# EAGLE design XICIE_AFE_SMD_revC (EAGLE 6.5.0)
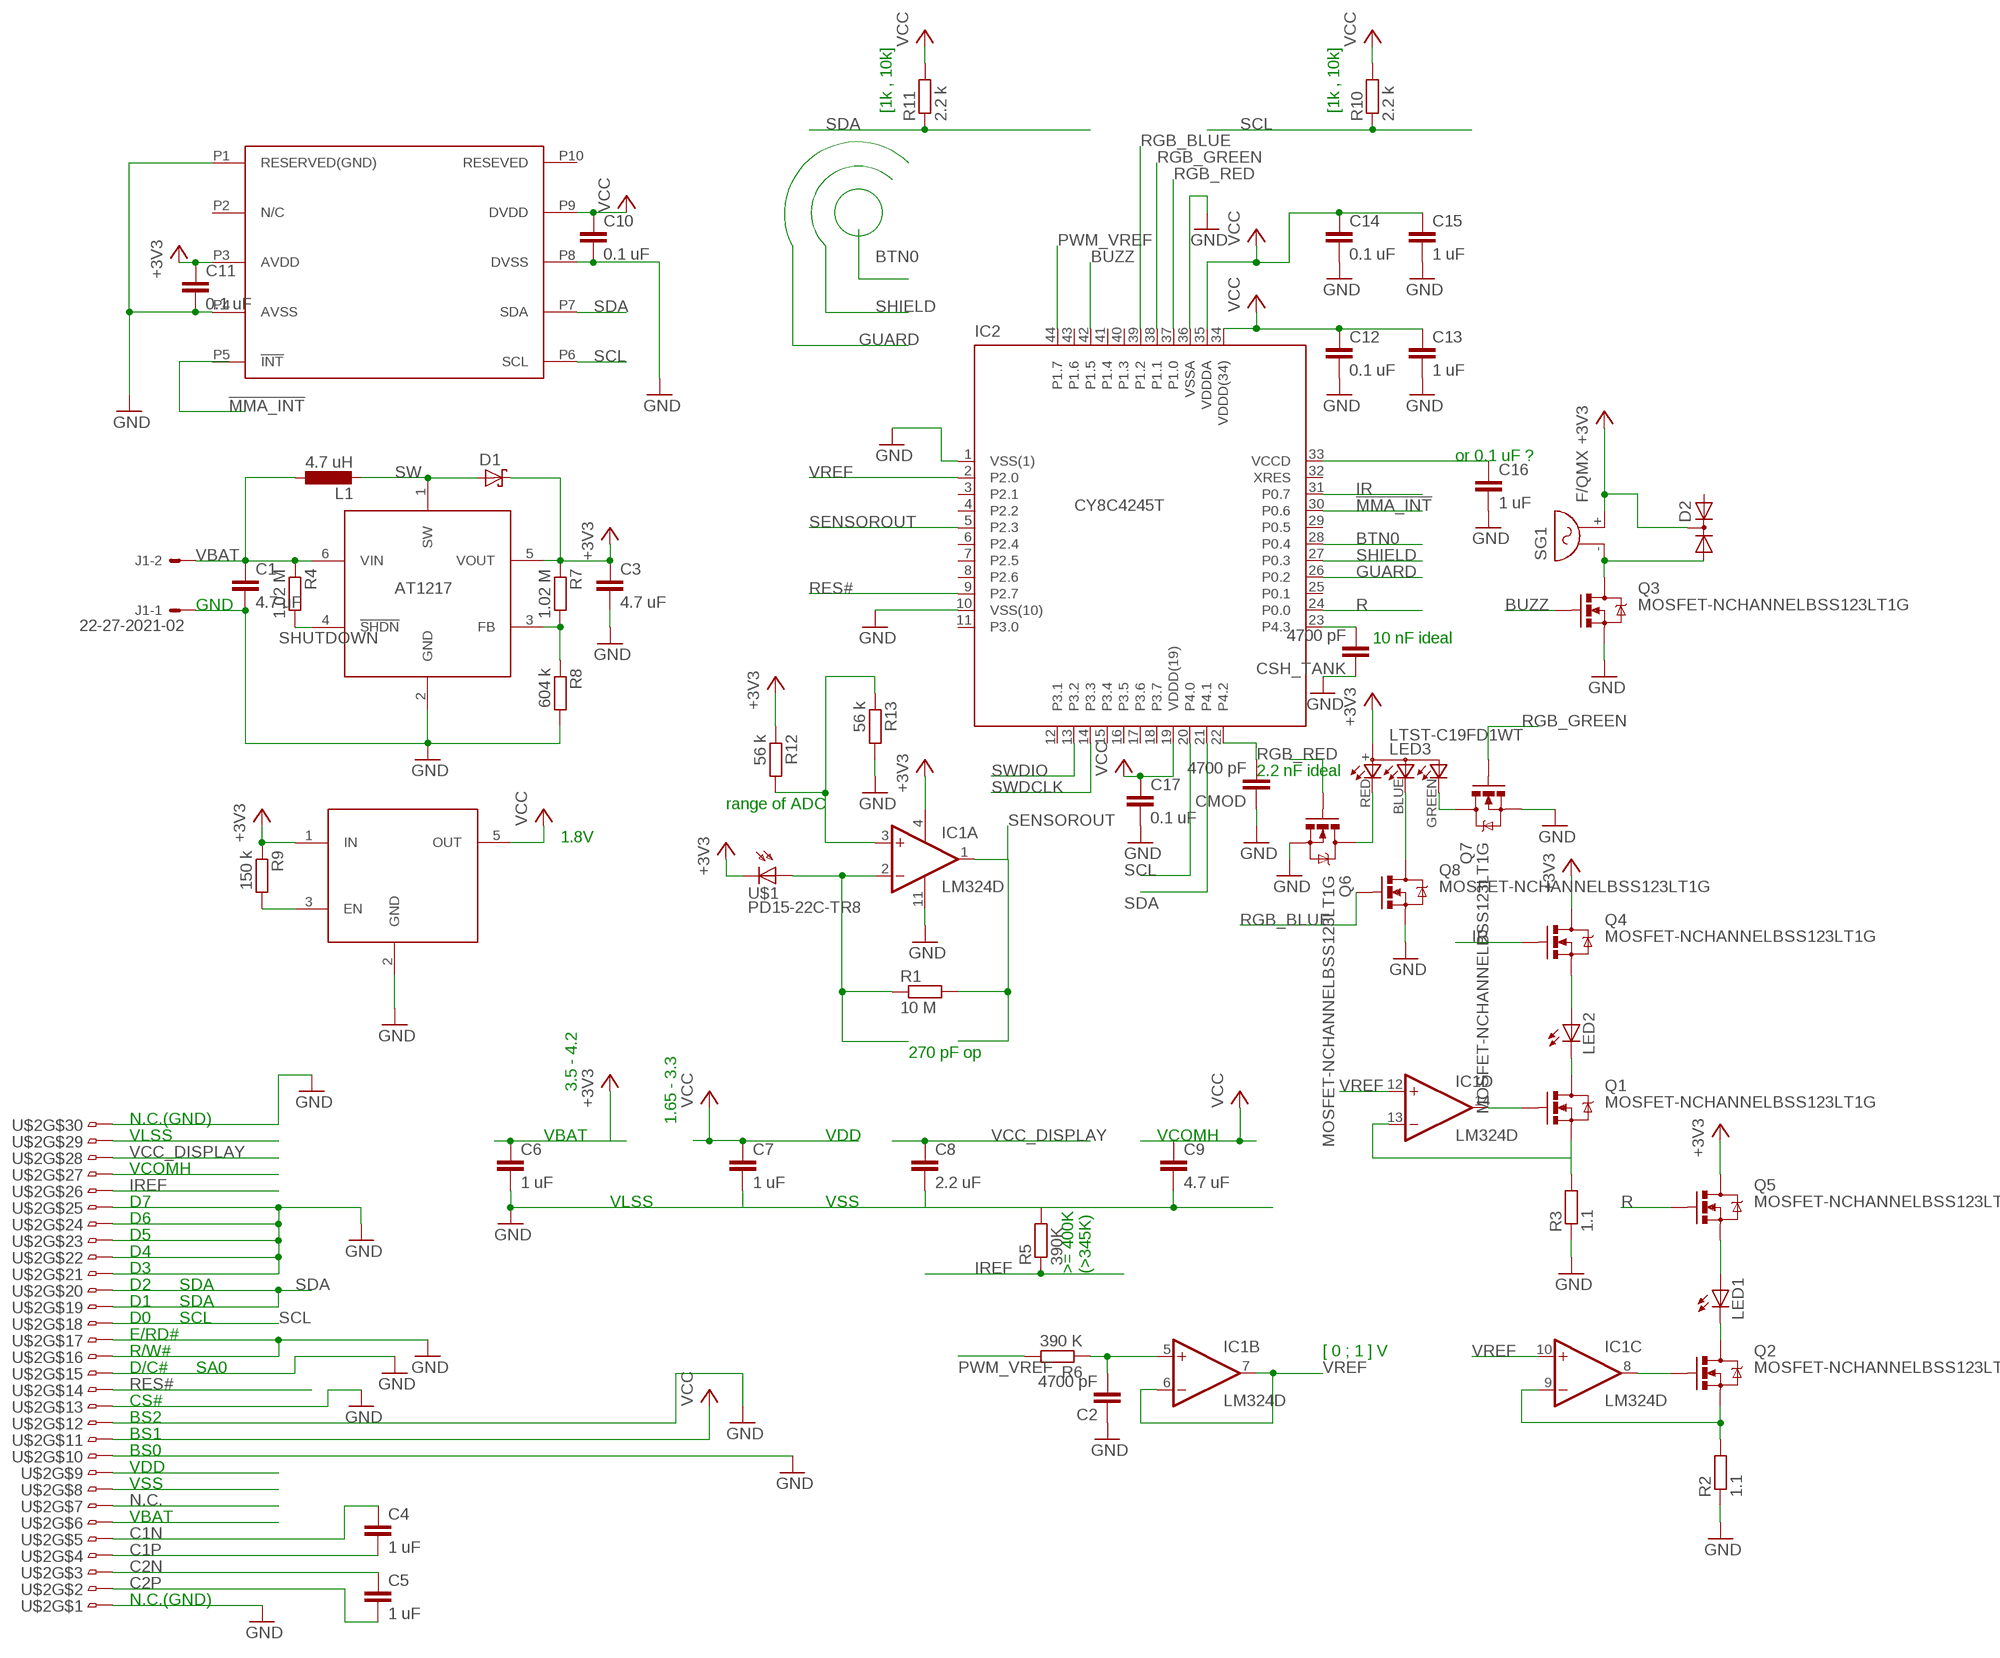
[diagram p0: schematic, sheet 1]

## Parts
C1  4.7 uF  C-EUC0603  [C0603]
C2  4700 pF  C-EUC0402  [C0402]
C3  4.7 uF  C-EUC0603  [C0603]
C4  1 uF  C-EUC0402  [C0402]
C5  1 uF  C-EUC0402  [C0402]
C6  1 uF  C-EUC0402  [C0402]
C7  1 uF  C-EUC0402  [C0402]
C8  2.2 uF  C-EUC0603  [C0603]
C9  4.7 uF  C-EUC0603  [C0603]
C10  0.1 uF  C-EUC0402  [C0402]
C11  0.1 uF  C-EUC0402  [C0402]
C12  0.1 uF  C-EUC0402  [C0402]
C13  1 uF  C-EUC0402  [C0402]
C14  0.1 uF  C-EUC0402  [C0402]
C15  1 uF  C-EUC0402  [C0402]
C16  1 uF  C-EUC0402  [C0402]
C17  0.1 uF  C-EUC0402  [C0402]
CMOD  4700 pF  C-EUC0402  [C0402]
CSH_TANK  4700 pF  C-EUC0402  [C0402]
D1  SCHOTTKY-DIODESMD  [SMINI2-F5-B]
D2  DIODE-2AC|CASOT23  [SOT23]
IC1  LM324D  [SO14]
IC2  CY8C4245T  [TQFP44]
IC3  AAT1217  [SOT23-6]
J1  22-27-2021-02  [6410-02]
L1  4.7 uH  L-EU  [L2518]
LED1  LED5MM  [LED5MM]
LED2  LED5MM  [LED5MM]
LED3  LTST-C19FD1WT  [GM1WA55311A]
Q1  MOSFET-NCHANNELBSS123LT1G  [SOT23]
Q2  MOSFET-NCHANNELBSS123LT1G  [SOT23]
Q3  MOSFET-NCHANNELBSS123LT1G  [SOT23]
Q4  MOSFET-NCHANNELBSS123LT1G  [SOT23]
Q5  MOSFET-NCHANNELBSS123LT1G  [SOT23]
Q6  MOSFET-NCHANNELBSS123LT1G  [SOT23]
Q7  MOSFET-NCHANNELBSS123LT1G  [SOT23]
Q8  MOSFET-NCHANNELBSS123LT1G  [SOT23]
R1  10 M  R-EU_R0402  [R0402]
R2  1.1  R-EU_R0402  [R0402]
R3  1.1  R-EU_R0402  [R0402]
R4  1.02 M  R-EU_R0805  [R0805]
R5  390K  R-EU_R0603  [R0603]
R6  390 K  R-EU_R0603  [R0603]
R7  1.02 M  R-EU_R0805  [R0805]
R8  604 k  R-EU_R0603  [R0603]
R9  150 k  R-EU_R0603  [R0603]
R10  2.2 k  R-EU_R0402  [R0402]
R11  2.2 k  R-EU_R0402  [R0402]
R12  56 k  R-EU_R0603  [R0603]
R13  56 k  R-EU_R0603  [R0603]
SG1  F/QMX  [F/QMX]
U$1  PD15-22C-TR8  [PHOTO_SMD]
U$2  ER-OLED0.96  [FLEX0.7X30]
U$3  AAT3221  [SOT23-5]
U$4  MMA7660FC  [DFN10]

## Nets
!MMA_INT: IC2.30(P0.6)
+3V3 [V]: C3.1 C6.1 C11.1 D1.C D2.3(C) IC1.4(P:V+) IC3.5(VOUT) LED3.+(A) Q4.3(D) Q5.3(D) R7.1 R9.1 R12.1 SG1.+ U$1.CATHODE1(C) U$1.CATHODE2(C) U$2.P6 U$3.1(IN) U$4.P3(AVDD)
BTN0: IC2.28(P0.4)
BUZZ: IC2.42(P1.5) Q3.1(G)
C1N: C4.1 U$2.P5
C1P: C4.2 U$2.P4
C2N: C5.1 U$2.P3
C2P: C5.2 U$2.P2
GND [GND]: C1.2 C2.1 C3.2 C6.2 C7.2 C8.2 C9.2 C10.2 C11.2 C12.2 C13.2 C14.2 C15.2 C16.2 C17.2 CMOD.1 CSH_TANK.1 IC1.11(P:V-) IC2.1(VSS(1)) IC2.10(VSS(10)) IC2.36(VSSA) IC3.2(GND) J1.1 Q3.2(S) Q6.2(S) Q7.2(S) Q8.2(S) R2.1 R3.1 R5.2 R8.2 R13.2 U$2.P1 U$2.P8 U$2.P10 U$2.P12 U$2.P13 U$2.P15 U$2.P16 U$2.P17 U$2.P21 U$2.P22 U$2.P23 U$2.P24 U$2.P25 U$2.P29 U$2.P30 U$3.2(GND) U$4.P1(RESERVED(GND)) U$4.P4(AVSS) U$4.P8(DVSS)
GUARD: IC2.26(P0.2)
IR: IC2.31(P0.7) Q4.1(G)
IREF: R5.1 U$2.P26
N$1: IC1.2(A:-IN) R1.1 U$1.ANODE1(A) U$1.ANODE2(A)
N$3: IC1.9(C:-IN) Q2.2(S) R2.2
N$4: LED2.A Q4.2(S)
N$5: LED1.K(C) Q2.3(D)
N$6: LED2.K(C) Q1.3(D)
N$7: IC1.8(C:OUT) Q2.1(G)
N$8: IC1.13(D:-IN) Q1.2(S) R3.2
N$9: C2.2 IC1.5(B:+IN) R6.1
N$10 [V]: C16.1 IC2.33(VCCD)
N$12: IC3.3(FB) R7.2 R8.1
N$13: D2.1(A1) Q3.3(D) SG1.-
N$14: R9.2 U$3.3(EN)
N$15: IC1.3(A:+IN) R12.2 R13.1
N$16: LED1.A Q5.2(S)
N$17: LED3.RED(CRED) Q6.3(D)
N$18: LED3.BLUE(CBLUE) Q8.3(D)
N$19: IC1.14(D:OUT) Q1.1(G)
N$20: LED3.GREEN(CGREEN) Q7.3(D)
N$21: CMOD.2 IC2.22(P4.2)
N$22: CSH_TANK.2 IC2.23(P4.3)
N.C.: U$2.P7
PWM_VREF: IC2.44(P1.7) R6.2
R: IC2.24(P0.0) Q5.1(G)
RES#: IC2.9(P2.7) U$2.P14
RGB_BLUE: IC2.39(P1.2) Q8.1(G)
RGB_GREEN: IC2.38(P1.1) Q7.1(G)
RGB_RED: IC2.37(P1.0) Q6.1(G)
SCL: IC2.20(P4.0) R10.1 U$2.P18 U$4.P6(SCL)
SDA: IC2.21(P4.1) R11.1 U$2.P19 U$2.P20 U$4.P7(SDA)
SENSOROUT: IC1.1(A:OUT) IC2.5(P2.3) R1.2
SHIELD: IC2.27(P0.3)
SHUTDOWN: IC3.4(!SHDN) R4.2
SW: D1.A IC3.1(SW) L1.2
SWDCLK: IC2.14(P3.3)
SWDIO: IC2.13(P3.2)
VBAT [V]: C1.1 IC3.6(VIN) J1.2 L1.1 R4.1
VCC [V]: C7.1 C9.1 C10.1 C12.1 C13.1 C14.1 C15.1 C17.1 IC2.19(VDDD(19)) IC2.34(VDDD(34)) IC2.35(VDDDA) R10.2 R11.2 U$2.P9 U$2.P11 U$2.P27 U$3.5(OUT) U$4.P9(DVDD)
VCC_DISPLAY [V]: C8.1 U$2.P28
VREF: IC1.6(B:-IN) IC1.7(B:OUT) IC1.10(C:+IN) IC1.12(D:+IN) IC2.2(P2.0)
Unconnected: D2.2(A2) IC2.3(P2.1) IC2.6(P2.4) IC2.7(P2.5) IC2.11(P3.0) IC2.12(P3.1) IC2.15(P3.4) IC2.16(P3.5) IC2.18(P3.7) IC2.25(P0.1) IC2.29(P0.5) IC2.32(XRES) IC2.40(P1.3) IC2.41(P1.4) IC2.43(P1.6) U$4.P2(N/C) U$4.P5(!INT) U$4.P10(RESEVED)

## Notes on the sheet
- [1k , 10k] | [1k , 10k]
- or 0.1 uF ?
- GND
- 10 nF ideal
- 2.2 nF ideal
- range of ADC
- 1.8V
- 270 pF op
- 3.5 - 4.2
- N.C.(GND) | 1.65 - 3.3
- VLSS | VBAT | VDD | VCOMH
- VCOMH
- D7 | VLSS | VSS
- D6
- D5
- D4
- D3
- >= 400K
  (>345K)
- D2 | SDA
- D1 | SDA
- D0 | SCL
- E/RD#
- R/W# | [ 0 ; 1 ] V
- D/C# | SA0
- CS#
- BS2
- BS1
- BS0
- VDD
- VSS
- VBAT
- N.C.(GND)

## Power pins joined to a net without a drawn wire
P2.2: IC2.4(P2.2)
P2.6: IC2.8(P2.6)
P3.6: IC2.17(P3.6)

## Library data of the parts
C1-C17 CMOD CSH_TANK = rcl:C-EU: CAPACITOR, European symbol
D1 = juliano:SCHOTTKY-DIODE: Schottky Diode
D2 = diode:DIODE-2AC|CA: Dual DIODE Anode-Cathode|Cathode-Anode
IC1 = linear:LM324: OP AMP
IC2 = juliano:CY8C4245: PSoC® Programmable System-on-Chip TM M8C Processor Speeds up to 24 MHz Source: http://www.cypress.com .. CY8C4245AXI-483; OC_FARNELL: unknown; OC_NEWARK: unknown
IC3 = juliano:AAT1217
J1 = con-molex:22-?-02: CONNECTOR wire to board 2.54 mm (.1 inch) pitch header; OC_FARNELL: unknown; OC_NEWARK: unknown
L1 = juliano:L-EU: INDUCTOR, European symbol
LED1 LED2 = led:LED: LED OSRAM: - CHIPLED LG R971, LG N971, LY N971, LG Q971, LY Q971, LO R971, LY R971 LH N974, LH R974 LS Q976, LO Q976, LY Q976 LO Q996 - Hyper CHIPLED LW Q18S LB Q993, LB Q99A, LB R99A - SideLED LS A670, LO A670, LY A670, LG A670, LP A670 LB A673, LV A673, LT A673, LW A673 LH A674 LY A675 LS A676, LA A676, LO A676, LY A676, LW A676 LS A679, LY A679, LG A679 - Hyper Micro SIDELED® LS Y876, LA Y876, LO Y876, LY Y876 LT Y87S - SmartLED LW L88C, LW L88S LB L89C, LB L89S, LG L890 LS L89K, LO L89K, LY L89K LS L896, LA L896, LO L896, LY L896 - TOPLED LS T670, LO T670, LY T670, LG T670, LP T670 LSG T670, LSP T670, LSY T670, LOP T670, LYG T670 LG T671, LOG T671, LSG T671 LB T673, LV T673, LT T673, LW T673 LH T674 LS T676, LA T676, LO T676, LY T676, LB T676, LH T676, LSB T676, LW T676 LB T67C, LV T67C, LT T67C, LS T67K, LO T67K, LY T67K, LW E67C LS E67B, LA E67B, LO E67B, LY E67B, LB E67C, LV E67C, LT E67C LW T67C LS T679, LY T679, LG T679 LS T770, LO T770, LY T770, LG T770, LP T770 LB T773, LV T773, LT T773, LW T773 LH T774 LS E675, LA E675, LY E675, LS T675 LS T776, LA T776, LO T776, LY T776, LB T776 LHGB T686 LT T68C, LB T68C - Hyper Mini TOPLED® LB M676 - Mini TOPLED Santana® LG M470 LS M47K, LO M47K, LY M47K Source: http://www.osram.convergy.de LUXEON: - LUMILED® LXK2-PW12-R00, LXK2-PW12-S00, LXK2-PW14-U00, LXK2-PW14-V00 LXK2-PM12-R00, LXK2-PM12-S00, LXK2-PM14-U00 LXK2-PE12-Q00, LXK2-PE12-R00, LXK2-PE12-S00, LXK2-PE14-T00, LXK2-PE14-U00 LXK2-PB12-K00, LXK2-PB12-L00, LXK2-PB12-M00, LXK2-PB14-N00, LXK2-PB14-P00, LXK2-PB14-Q00 LXK2-PR12-L00, LXK2-PR12-M00, LXK2-PR14-Q00, LXK2-PR14-R00 LXK2-PD12-Q00, LXK2-PD12-R00, LXK2-PD12-S00 LXK2-PH12-R00, LXK2-PH12-S00 LXK2-PL12-P00, LXK2-PL12-Q00, LXK2-PL12-R00 Source: www.luxeon.com KINGBRIGHT: KA-3528ASYC Source: www.kingbright.com
LED3 = juliano:LTST-C19FD1WT: Chip LED RGB Source: http://optoelectronics.liteon.com/upload/download/DS22-2001-076/S_110_LTST-C19FD1WT.pdf
Q1-Q8 = SparkFun-DiscreteSemi:MOSFET-NCHANNEL: Common NMOSFET Parts MFG P/N Store ID Prod ID FDD8780 TRANS-09984 SI7820DN TRANS-11055 FDS6630A IC-08089 2N7002PW TRANS-11151 FQP30N06L COM-10213 TRANS-10060 BSS123LT1G TRANS-08345 BSS138 TRANS-00830 BS170 2N7000; PROD_ID: TRANS-08345
R1-R4 R6-R13 = rcl:R-EU_: RESISTOR, European symbol
R5 = resistor:R-EU_: RESISTOR, European symbol
SG1 = buzzer:F/QMX: BUZZER Source: Buerklin; OC_FARNELL: unknown; OC_NEWARK: unknown
U$1 = juliano:PD15-22C-TR8
U$2 = juliano:ER-OLED0.96
U$3 = juliano:AAT3221
U$4 = juliano:MMA7660FC

## Board
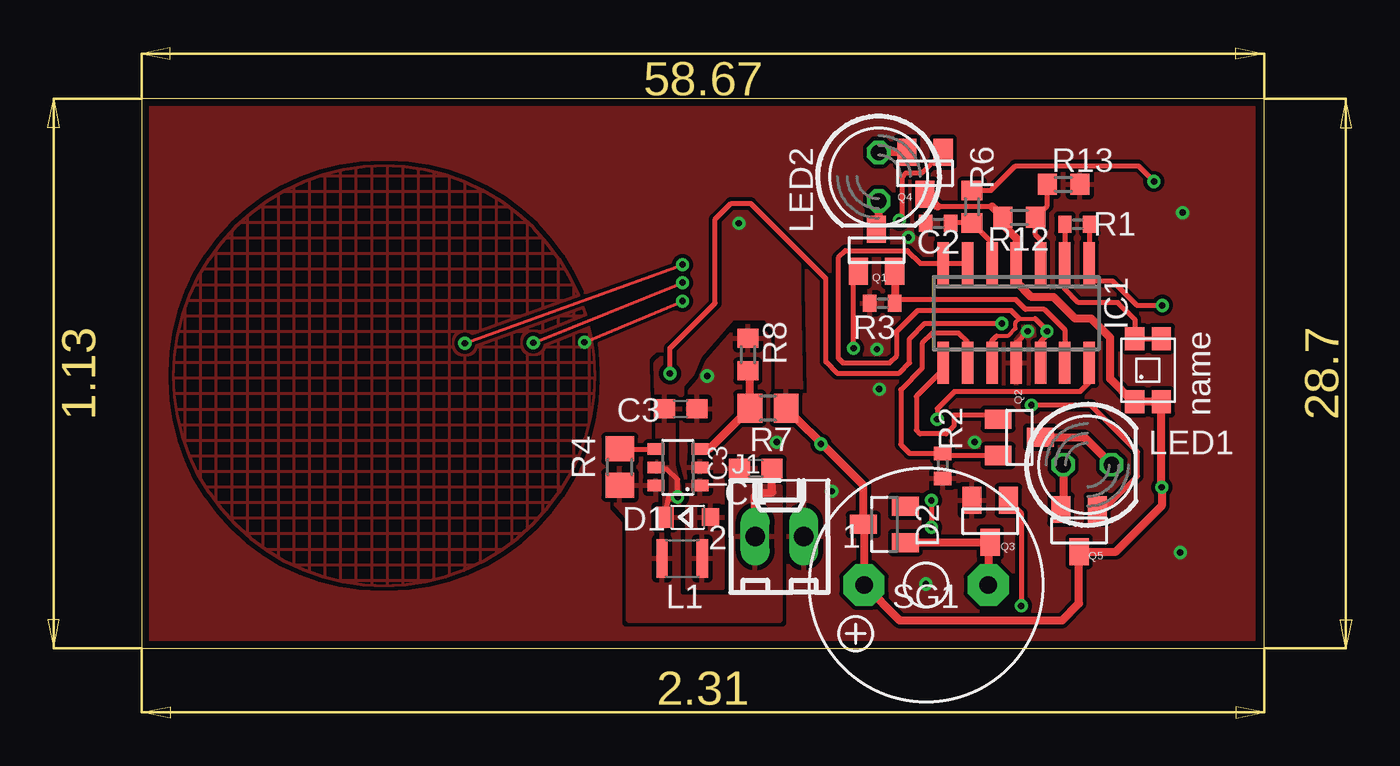
[diagram p1: board, top side]
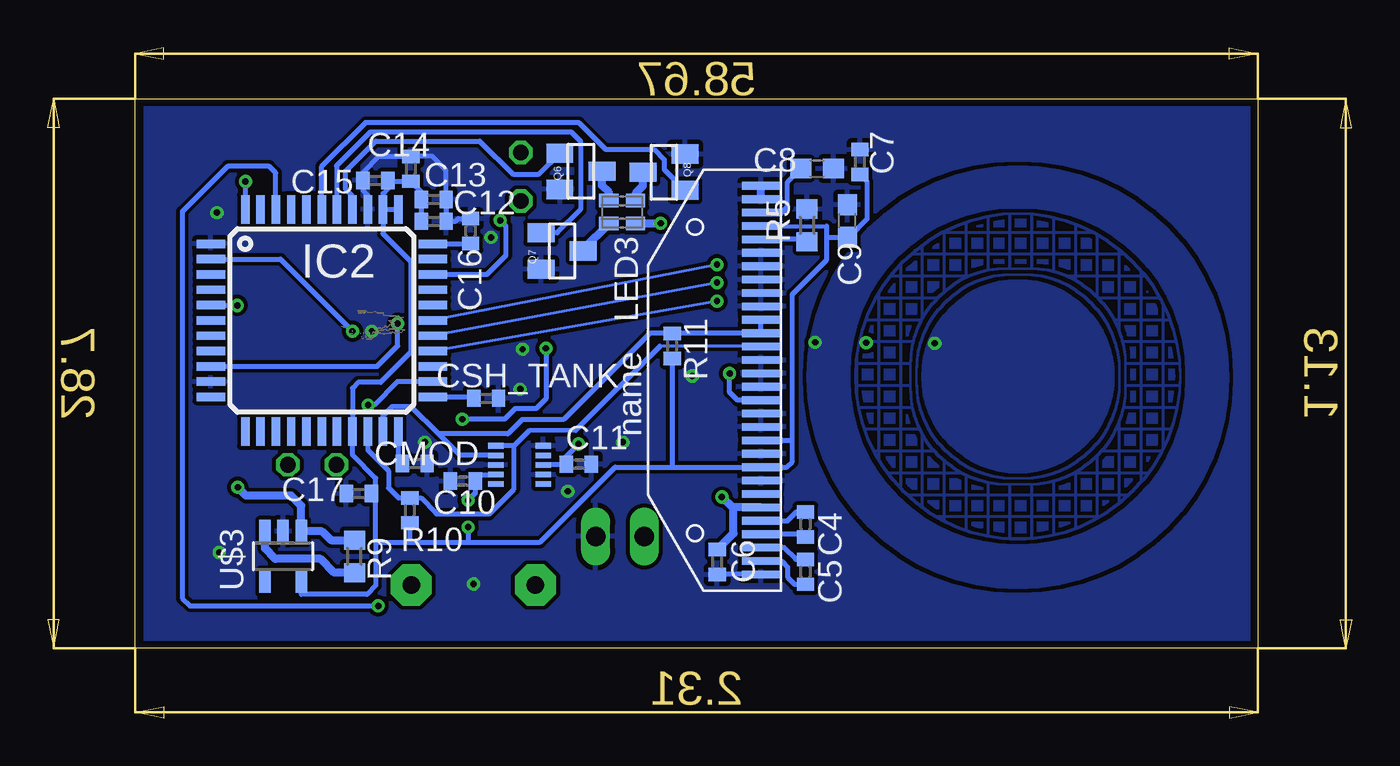
[diagram p2: board, bottom side, seen from below]

Size 58.67 x 28.7 mm. Coordinates in mm from the lower left corner, seen from the top.
Outline: 0,0 58.67,0 58.67,28.7 0,28.7 0,0
Copper layers (1*16): Top 0.0356mm / dielectric 1.5011mm / Bottom 0.0356mm
Design rules "LaenPCBOrder *": minimum track width 6mil, minimum drill 13mil, track to track 8mil, track to pad 8mil, pad to pad 8mil, via to via 8mil, smd to smd 6mil, copper to edge 15mil, drill to drill 6mil, minimum pad ring 7mil, minimum via ring 7mil, stop-mask expansion 3mil, vias tented up to drill 0mil, thermal gap 10mil

### Footprints (pad centres in the part's own frame; a part is rotated, then mirrored left to right if it is on the bottom)
C0603 = smd 1.1 x 1: 1 -0.85,0; 2 0.85,0
C0402 = smd 0.7 x 0.9: 1 -0.65,0; 2 0.65,0
SMINI2-F5-B = smd 0.9 x 0.9: A 1.2,0 | smd 0.9 x 1.1: C -1.2,0
SOT23 = smd 1 x 1.4: 1 -0.95,-1.1; 2 0.95,-1.1; 3 0,1.1
SO14 = smd 0.6 x 2.2: 1 -3.81,-2.6; 2 -2.54,-2.6; 3 -1.27,-2.6; 4 0,-2.6; 5 1.27,-2.6; 6 2.54,-2.6; 7 3.81,-2.6; 8 3.81,2.6; 9 2.54,2.6; 10 1.27,2.6; 11 0,2.6; 12 -1.27,2.6; 13 -2.54,2.6; 14 -3.81,2.6
TQFP44 = smd 1.5 x 0.44: 1 -5.8,4; 2 -5.8,3.2; 3 -5.8,2.4; 4 -5.8,1.6; 5 -5.8,0.8; 6 -5.8,0; 7 -5.8,-0.8; 8 -5.8,-1.6; 9 -5.8,-2.4; 10 -5.8,-3.2; 11 -5.8,-4; 23 5.8,-4; 24 5.8,-3.2; 25 5.8,-2.4; 26 5.8,-1.6; 27 5.8,-0.8; 28 5.8,0; 29 5.8,0.8; 30 5.8,1.6; 31 5.8,2.4; 32 5.8,3.2; 33 5.8,4 | smd 0.44 x 1.5: 12 -4,-5.8; 13 -3.2,-5.8; 14 -2.4,-5.8; 15 -1.6,-5.8; 16 -0.8,-5.8; 17 0,-5.8; 18 0.8,-5.8; 19 1.6,-5.8; 20 2.4,-5.8; 21 3.2,-5.8; 22 4,-5.8; 34 4,5.8; 35 3.2,5.8; 36 2.4,5.8; 37 1.6,5.8; 38 0.8,5.8; 39 0,5.8; 40 -0.8,5.8; 41 -1.6,5.8; 42 -2.4,5.8; 43 -3.2,5.8; 44 -4,5.8
SOT23-6 = smd 0.6 x 0.9: 1 -0.95,-1.15; 2 0,-1.15; 3 0.95,-1.15; 4 0.95,1.15; 5 0,1.15; 6 -0.95,1.15
6410-02 = drill 1.016 long: 1 1.27,0; 2 -1.27,0
L2518 = smd 0.6 x 2: 1 -1.05,0; 2 1.05,0
LED5MM = drill 0.813 octagon: A -1.27,0; K 1.27,0
GM1WA55311A = smd 0.7 x 1: + 0.6,0.7; BLUE -0.6,0.7; GREEN 0.6,-0.7; RED -0.6,-0.7
R0402 = smd 0.7 x 0.9: 1 -0.65,0; 2 0.65,0
R0805 = smd 1.3 x 1.5: 1 -0.95,0; 2 0.95,0
R0603 = smd 1 x 1.1: 1 -0.85,0; 2 0.85,0
F/QMX = drill 0.914 pad 2.159 octagon: + 3.251,0; - -3.251,0
PHOTO_SMD = smd 1.2 x 1: ANODE1 -1.65,0.7; ANODE2 -1.65,-0.7; CATHODE1 1.65,0.7; CATHODE2 1.65,-0.7
FLEX0.7X30 = smd 0.4 x 2: P1 -10.15,0; P2 -9.45,0; P3 -8.75,0; P4 -8.05,0; P5 -7.35,0; P6 -6.65,0; P7 -5.95,0; P8 -5.25,0; P9 -4.55,0; P10 -3.85,0; P11 -3.15,0; P12 -2.45,0; P13 -1.75,0; P14 -1.05,0; P15 -0.35,0; P16 0.35,0; P17 1.05,0; P18 1.75,0; P19 2.45,0; P20 3.15,0; P21 3.85,0; P22 4.55,0; P23 5.25,0; P24 5.95,0; P25 6.65,0; P26 7.35,0; P27 8.05,0; P28 8.75,0; P29 9.45,0; P30 10.15,0
SOT23-5 = smd 0.6 x 1.2: 1 -0.95,-1.306; 2 0,-1.306; 3 0.95,-1.306; 4 0.95,1.306; 5 -0.95,1.306
DFN10 = smd 0.3 x 0.825: P1 -1,1.24; P2 -0.5,1.24; P3 0,1.24; P4 0.5,1.24; P5 1,1.24; P6 -1,-1.24; P7 -0.5,-1.24; P8 0,-1.24; P9 0.5,-1.24; P10 1,-1.24

### Placement (x,y rotation side)
C1  32.1,9.39 180 top
C2  41.64,22.2 0 top
C3  28.17,12.5 0 top
C4  23.65,6.47 270 bottom
C5  23.65,3.99 270 bottom
C6  28.26,4.5 270 bottom
C7  20.81,25.4 90 bottom
C8  23.04,25.06 0 bottom
C9  21.46,22.32 90 bottom
C10  41.55,8.73 180 bottom
C11  35.49,9.62 0 bottom
C12  43.08,22.3 0 bottom
C13  43.08,23.44 0 bottom
C14  44.27,25.04 90 bottom
C15  46.13,24.43 180 bottom
C16  41.15,21.79 90 bottom
C17  46.99,8.08 180 bottom
CMOD  44.07,9.65 180 bottom
CSH_TANK  40.34,13.06 180 bottom
D1  28.54,6.85 0 top
D2  38.82,6.47 90 top
IC1  45.71,17.51 180 top
IC2  48.93,17.13 0 bottom
IC3  28.03,9.45 90 top
J1  33.34,5.84 0 top
L1  28.25,4.69 0 top
LED1  49.43,9.58 0 top
LED2  38.52,24.63 270 top
LED3  33.22,22.78 270 bottom
Q1  38.41,20.79 0 top
Q2  45.87,11.02 270 top
Q3  44.35,6.63 180 top
Q4  40.94,24.82 180 top
Q5  49,6.15 180 top
Q6  35.38,24.92 270 bottom
Q7  36.37,20.75 270 bottom
Q8  31.04,24.87 90 bottom
R1  48.91,22.15 0 top
R2  41.87,9.53 90 top
R3  38.71,18.02 0 top
R4  24.99,9.47 90 top
R5  23.56,22.09 90 bottom
R6  43.4,23.07 90 top
R7  32.74,12.54 180 top
R8  31.69,15.34 90 top
R9  47.22,4.79 270 bottom
R10  44.33,7.2 270 bottom
R11  30.61,15.79 270 bottom
R12  45.87,22.5 0 top
R13  48.18,24.23 0 top
SG1  41,3.31 180 top
U$1  52.6,14.52 270 top
U$2  25.97,14.01 90 bottom
U$3  50.95,4.8 180 bottom
U$4  38.59,9.57 270 bottom

### Tracks (layer width: path | path; a pad name or v marks a point on that pad's centre or on a via)
+3V3  (via drill 0.33)
  Top 0.254: IC3.5 26.96,9.37 27.41,9.37 28.02,8.81 v28.02,7.9 27.56,7.9 D1.C | v35.51,10.67 36.12,10.11 | 44.46,23.06 41.6,23.06
  Top 0.406: R7.1 36.12,10.11 37.72,8.51 D2.3 37.75,6.44 SG1.+ 37.77,3.3 39.62,1.45 48.11,1.45 49,2.34 Q5.3 50.92,5.05 53.31,7.44 v53.31,8.41 53.3,8.42 U$1.CATHODE1 U$1.CATHODE2 51.82,12.87 50.62,14.07 50.62,16.23 49.63,17.22 48.79,17.22 47.68,18.34 46.51,18.34 45.71,19.13 IC1.4 45.71,21.42 45.02,22.11 R12.1 44.46,23.06 | Q4.3 41.6,23.06
  Bottom 0.254: U$4.P3 36.18,9.57 C11.1 36.14,10.04 v35.51,10.67
  Bottom 0.406: R9.1 48.44,5.64 48.91,6.11 U$3.1 50,7.45 50.52,7.98 52.88,7.98 v53.31,8.41 | v31.22,22.2 31.23,22.18 LED3.+ | U$2.P6 27.41,7.36 | 27.41,7.36 27.47,7.36 v28.02,7.9 | C6.1 27.41,6 27.41,7.36
  pour Top (isolate 0.229, rank 5): 26.89,14.91 30.1,17.86 29.72,21.95 31.42,23.65 34.34,20.73 34.34,18.59 34.44,13.28 33.22,13.13 33.22,16.43 32.64,17.25 30.86,17.25 29.13,15.24 28.75,14.33 28.22,13.72 28.19,11.79 27.76,11.79 27.76,9.52 28.22,7.9 28.22,6.05 27.01,6.07 26.99,11.35
BTN0  (via drill 0.33)
  Top 0.152: v16.89,15.94 v28.27,20.04
  Bottom 0.152: v28.27,20.04 IC2.28
  pour Bottom: 17.54,14.2 arc-180 7.54,14.2 arc-180
BUZZ  (via drill 0.33)
  Top 0.254: Q3.1 45.97,7.05 v45.97,2.21
  Bottom 0.254: IC2.42 51.33,24.83 51.66,25.17 53.85,25.17 56.21,22.81 56.21,2.62 55.8,2.21 v45.97,2.21
C1N
  Bottom 0.254: U$2.P5 24.59,6.66 24.12,7.12 C4.1
C1P
  Bottom 0.254: C4.2 23.79,5.96 U$2.P4
C2N
  Bottom 0.254: C5.1 24.15,4.64 24.76,5.26 U$2.P3
C2P
  Bottom 0.254: U$2.P2 24.9,4.56 24.59,4.24 24.59,3.71 24.22,3.34 C5.2
GND  (via drill 0.33)
  Top 0.254: v46.3,16.56 45.71,15.97 IC1.11
  Bottom 0.254: IC2.36 46.52,23.66 46.78,23.92 C15.2 46.75,24.46 46.75,24.88 45.93,25.69 C14.2 43.14,25.69 42.43,24.98 C13.2 C12.2 41.94,22.3 41.79,22.44 C16.2 | U$2.P1 C6.2
  Bottom 0.406: U$2.P29 U$2.P30
  other vias: 33.2,10.77 36.07,8.2 43.54,10.77 41,3.35 54.41,22.76 40.08,21.46 38.43,15.62 38.56,13.54 54.28,5 29.57,14.22
  pour Bottom (rank 6): 0.05,-0.46 58.09,-0.46 58.09,29.21 0.03,29.21
  pour Top (rank 6): 0.05,-0.46 58.09,-0.46 58.09,29.21 0.03,29.21
GUARD  (via drill 0.33)
  Top 0.152: v23.14,15.99 v28.27,18.14
  Bottom 0.152: v28.27,18.14 IC2.26
  pour Bottom (rank 3): 23.54,14.15 arc-180 1.54,14.15 arc-180
  pour Top (rank 3, hatched): 23.67,14.23 arc-180 1.67,14.23 arc-180
IR  (via drill 0.33)
  Top 0.254: Q4.1 40.8,24.82 39.93,24.82 39.73,24.61 39.73,22.48 v39.6,22.35
  Bottom 0.254: IC2.31 40.29,19.53 39.29,20.52 39.29,22.05 v39.6,22.35
IREF
  Bottom 0.254: R5.1 23.67,21.36 U$2.P26
N$1
  Top 0.254: U$1.ANODE1 U$1.ANODE2 51.9,17.19 51.03,18.06 48.97,18.06 48.25,18.78 IC1.2 R1.1
N$3
  Top 0.254: IC1.9 43.17,15.98 42.7,16.46 41.33,16.46 40.79,15.93 40.79,14.63 39.68,13.51 39.68,10.64 40.14,10.18 R2.2 41.97,10.07 Q2.2 44.49,9.79
N$4
  Top 0.406: Q4.2 38.54,25.92 LED2.A
N$5
  Top 0.406: Q2.3 49.27,11.02 LED1.K
N$6
  Top 0.406: 38.52,22.02 Q1.3 38.52,21.89 LED2.K
N$7
  Top 0.254: IC1.8 41.9,14.57 40.49,13.16 40.49,11.4 40.69,11.2 42.04,11.2 42.44,11.61 42.44,12.19 44.15,12.19 44.37,11.97 Q2.1
N$8
  Top 0.254: IC1.13 48.25,16.64 47.19,17.7 46.2,17.7 45.7,18.21 39.55,18.21 R3.2
  Top 0.406: Q1.2 39.36,19.71 R3.2
N$9
  Top 0.254: IC1.5 44.44,21.18 R6.1 42.3,22.22 C2.2
N$10
  Bottom 0.254: IC2.33 43.11,21.14 C16.1
N$12
  Top 0.406: IC3.3 29.65,10.4 R7.2 31.79,14.39 R8.1
N$13
  Top 0.406: SG1.- 44.26,5.43 Q3.3 D2.1
N$14
  Bottom 0.406: R9.2 48.27,3.94 49,4.67 51.36,4.67 51.9,5.21 U$3.3
N$15
  Top 0.254: IC1.3 46.98,21.34 46.72,21.6 R12.2 47.33,23.12 R13.1
N$16
  Top 0.406: LED1.A 48.16,7.36 Q5.2
N$17
  Bottom 0.406: LED3.RED 33.92,23.81 34.28,24.17 Q6.3
N$18
  Bottom 0.406: LED3.BLUE 32.52,23.76 32.14,24.15 Q8.3
N$19  (via drill 0.33)
  Top 0.254: v37.21,15.67 37.21,19.46 Q1.1 | IC1.14 49.52,13.89 49.05,13.41 42.47,13.41 41.58,12.52 v41.58,11.96
  Bottom 0.254: v41.58,11.96 39.37,11.96 38.81,12.52 37.72,12.52 37.21,13.03 v37.21,15.67
N$20
  Bottom 0.406: LED3.GREEN 35.27,20.83 Q7.3
N$21
  Bottom 0.254: IC2.22 44.93,9.86 CMOD.2
N$22
  Bottom 0.254: IC2.23 40.98,13.13 CSH_TANK.2
PWM_VREF  (via drill 0.33)
  Top 0.254: R6.2 44.39,23.92 45.67,25.2 52.09,25.2 v52.91,24.38
  Bottom 0.254: IC2.44 52.91,22.94 v52.91,24.38
R  (via drill 0.33)
  Top 0.254: Q5.1 50.3,7.25 52.05,8.99 52.05,10.26 49.61,12.7 v46.51,12.7
  Bottom 0.254: IC2.24 44.98,13.93 46.2,12.7 v46.51,12.7
RES#  (via drill 0.33)
  Top 0.254: v27.61,14.35 27.61,15.67 29.97,18.03 29.97,22.4 30.81,23.24 31.83,23.24 35.76,19.3 35.76,14.96 36.35,14.38 39.6,14.38 40.13,14.91 40.13,16.18 40.92,16.97 v44.96,16.97
  Bottom 0.254: IC2.9 46.03,14.73 44.96,15.8 v44.96,16.97 | U$2.P14 27.21,12.96 27.61,13.36 v27.61,14.35
RGB_BLUE
  Bottom 0.254: Q8.1 31.04,25.02 31.04,25.53 31.57,26.06 34.09,26.06 35.48,27.46 46.63,27.46 48.93,25.17 IC2.39
RGB_GREEN
  Bottom 0.254: Q7.1 36.62,21.7 35.41,22.91 35.41,26.49 35.89,26.98 46.38,26.98 48.16,25.2 48.16,22.96 IC2.38
RGB_RED
  Bottom 0.254: IC2.37 47.33,23.6 47.68,23.95 47.68,24.92 46.1,26.49 40.66,26.49 38.94,24.76 37.59,24.76 Q6.1
SCL
  Bottom 0.152: 31.24,15.8 26.01,15.8
  Bottom 0.203: 31.26,15.78 31.24,15.8 | 26.01,15.8 U$2.P18
  Bottom 0.254: 31.26,15.78 35.66,11.38 38.1,11.35 38.88,10.57 | 38.88,10.57 U$4.P6 | IC2.20 46.52,10.35 45.44,9.27 45.44,8.38 44.91,7.85 R10.1 43.74,7.85 42.98,7.09 arc-90 42.9,7.01 40.18,7.01 38.88,8.31 38.88,10.57 | 25.99,15.78 U$2.P18
SDA
  Bottom 0.254: U$2.P20 U$2.P19 30.61,16.46 | 30.61,16.46 31.78,16.46 36.3,11.94 38.46,11.94 39.19,11.2 42.82,11.2 | IC2.21 45.73,12.14 45.24,12.62 44.25,12.62 42.82,11.2 | R11.1 30.61,16.46 | U$4.P7 41.7,10.07 42.82,11.2
SENSOROUT  (via drill 0.33)
  Top 0.254: R1.2 49.52,22.12 IC1.1 49.52,19.18 49.53,19.18 50.75,19.18 52.02,17.91 v53.34,17.91
  Bottom 0.254: IC2.5 53.36,17.93 v53.34,17.91
SHIELD  (via drill 0.33)
  Top 0.152: v20.48,15.96 v28.27,19.1
  Bottom 0.152: v28.27,19.1 IC2.27
  pour Bottom (isolate 0.5, rank 2, hatched): 21.04,14.2 arc-180 4.04,14.2 arc-180
SHUTDOWN
  Top 0.254: R4.2 25.01,10.4 IC3.4
SW
  pour Top (isolate 0.254, rank 2): 30.34,8.84 30.34,3.15 28.55,3.15 28.55,8.79
VBAT
  Top 0.406: J1.2 32.07,7.99 32.21,8.13 32.95,8.13 C1.1
  pour Top (isolate 0.254, rank 3): 33.39,8.44 30.39,8.44 30.44,2.99 28.19,2.99 28.19,6.44 26.88,6.44 26.87,10.77 24.36,10.64 24.36,7.99 25.43,6.81 25.43,1.47 33.39,1.47
VCC  (via drill 0.33)
  Top 0.254: v41.27,7.72 v41.27,6.32
  Bottom 0.203: U$2.P27 22.53,22.06
  Bottom 0.254: IC2.35 45.73,23.74 45.48,23.99 C15.1 45.45,24.46 45.38,24.39 C14.1 43.73,23.85 C13.1 C12.1 | IC2.19 47.37,11.28 | U$4.P9 41.02,9.07 C10.1 40.9,8.09 v41.27,7.72 | U$2.P11 24.33,10.86 | 24.33,10.86 24.33,18.49 22.53,20.29 22.53,21.44 | 22.53,21.44 22.53,22.06 | 24.33,10.86 24.33,9.75 24.63,9.46 U$2.P9 30.61,9.46 | 46.1,5.54 46.1,3.28 46.56,2.82 50,2.82 U$3.5 | 46.1,5.54 44.33,5.54 | 44.33,5.54 41.33,5.54 | 41.33,5.54 37.52,5.54 33.6,9.46 30.61,9.46 | IC2.35 IC2.34 | IC2.35 45.73,21.66 44.27,20.21 44.27,15.47 45.85,13.89 47.02,13.89 47.33,13.58 IC2.19 | R10.2 44.33,5.54 | R11.2 30.61,9.46 | 46.1,5.54 46.1,8.08 | 46.1,8.08 46.1,8.89 47.33,10.11 IC2.19 | C17.1 46.1,8.08 | v41.27,6.32 41.27,5.59 41.33,5.54 | C7.1 20.42,24.37 20.42,22.43 21.38,21.47 C9.1 21.49,21.44 22.53,21.44
VCC_DISPLAY
  Bottom 0.254: U$2.P28 24.89,22.76 24.59,23.06 24.59,24.36 C8.1
VREF  (via drill 0.33)
  Top 0.203: 46.71,17.22 45.87,17.22 45.67,17.02 45.67,16.71 45.26,16.31 44.68,16.31
  Top 0.254: IC1.10 44.44,16.07 44.68,16.31 | IC1.6 IC1.7 40.7,20.11 40.03,20.78 36.78,20.78 36.4,20.4 36.4,15.16 36.65,14.91 39.09,14.91 39.47,15.29 39.47,16.56 40.56,17.65 45.44,17.65 45.87,17.22 | 46.71,17.22 47.32,16.61 v47.32,16.56 47.32,16.36 46.99,16.03 IC1.12
  Bottom 0.254: IC2.2 51.09,20.33 v47.32,16.56